# Altium schematic sheet MCU_FM.SchDoc
size A4; Organization: Altium Limited; Address1: L3, 12a Rodborough Rd; Address2: Frenchs Forest; Address3: NSW; Address4: Australia 2086; Stage: DRAFT
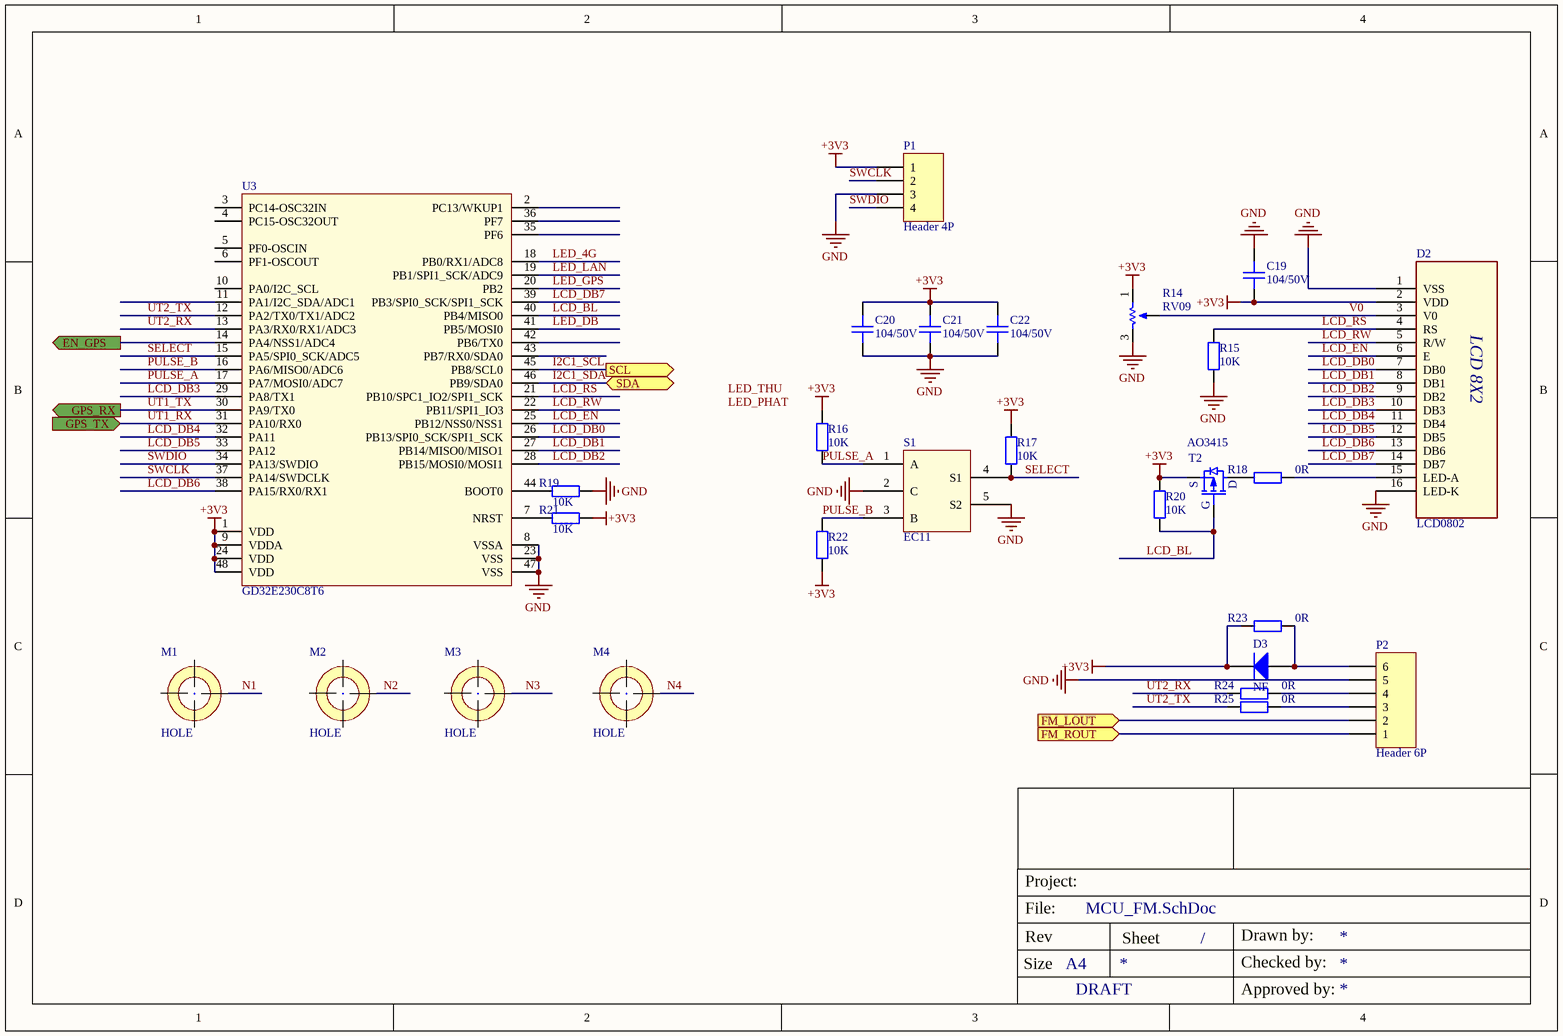
[diagram p0: MCU_FM.SchDoc]

## Parts
C19  104/50V  [CAPC-0603 (1608) - HD]
C20  104/50V  [CAPC-0603 (1608) - HD]
C21  104/50V  [CAPC-0603 (1608) - HD]
C22  104/50V  [CAPC-0603 (1608) - HD]
D2  LCD0802  [LCD 8X2 FORM 3]
D3  NF  [SOD-123]
M1  HOLE  [HOLE_3MM_6MM]  (no BOM)
M2  HOLE  [HOLE_3MM_6MM]  (no BOM)
M3  HOLE  [HOLE_3MM_6MM]  (no BOM)
M4  HOLE  [HOLE_3MM_6MM]  (no BOM)
P1  Header 4P  [HDR1X4 - W]
P2  Header 6P  [HDR1X6 - W]
R14  RV09  [RES_VAR_Type1]
R15  10K  [RESC-0603 (1608) - HD]
R16  10K  [RESC-0603 (1608) - HD]
R17  10K  [RESC-0603 (1608) - HD]
R18  0R  [RESC-0603 (1608) - HD]
R19  10K  [RESC-0603 (1608) - HD]
R20  10K  [RESC-0603 (1608) - HD]
R21  10K  [RESC-0603 (1608) - HD]
R22  10K  [RESC-0603 (1608) - HD]
R23  0R  [RESC-0603 (1608) - HD]
R24  0R  [RESC-0603 (1608) - HD]
R25  0R  [RESC-0603 (1608) - HD]
S1  EC11  [EC11]
T2  AO3415  [SOT23_3]
U3  GD32E230C8T6  [LQFP-48]

## Ports
EN_GPS (out), FM_LOUT (in), FM_ROUT (in), GPS_RX (out), GPS_TX (in), SCL (out), SDA (bidir)

## Nets
+3V3: C19.2 C20.2 C21.2 C22.2 D2.2(VDD) D3.2(K) P1.1 R14.1 R16.2 R17.2 R20.2 R21.2 R22.2 R23.1 T2.2(S) U3.1(VDD) U3.9(VDDA) U3.24(VDD) U3.48(VDD)
GND: C19.1 C20.1 C21.1 C22.1 D2.1(VSS) D2.16(LED-K) P1.3 P2.5 R14.3 R15.1 R19.2 S1.2(C) S1.5(S2) U3.8(VSSA) U3.23(VSS) U3.47(VSS)
EN_GPS: U3.14(PA4/NSS1/ADC4) ; port EN_GPS
FM_LOUT: P2.2 ; port FM_LOUT
FM_ROUT: P2.1 ; port FM_ROUT
I2C1_SCL: U3.45(PB8/SCL0) ; port SCL
I2C1_SDA: U3.46(PB9/SDA0) ; port SDA
LCD_BL: R20.1 T2.1(G) U3.40(PB4/MISO0)
LCD_DB0: D2.7(DB0) U3.26(PB13/SPI0_SCK/SPI1_SCK)
LCD_DB1: D2.8(DB1) U3.27(PB14/MISO0/MISO1)
LCD_DB2: D2.9(DB2) U3.28(PB15/MOSI0/MOSI1)
LCD_DB3: D2.10(DB3) U3.29(PA8/TX1)
LCD_DB4: D2.11(DB4) U3.32(PA11)
LCD_DB5: D2.12(DB5) U3.33(PA12)
LCD_DB6: D2.13(DB6) U3.38(PA15/RX0/RX1)
LCD_DB7: D2.14(DB7) U3.39(PB3/SPI0_SCK/SPI1_SCK)
LCD_EN: D2.6(E) U3.25(PB12/NSS0/NSS1)
LCD_RS: D2.4(RS) R15.2 U3.21(PB10/SPC1_IO2/SPI1_SCK)
LCD_RW: D2.5(R/W) U3.22(PB11/SPI1_IO3)
LED_4G: U3.18(PB0/RX1/ADC8)
LED_DB: U3.41(PB5/MOSI0)
LED_GPS: U3.20(PB2)
LED_LAN: U3.19(PB1/SPI1_SCK/ADC9)
PULSE_A: R16.1 S1.1(A) U3.17(PA7/MOSI0/ADC7)
PULSE_B: R22.1 S1.3(B) U3.16(PA6/MISO0/ADC6)
SELECT: R17.1 S1.4(S1) U3.15(PA5/SPI0_SCK/ADC5)
SWCLK: P1.2 U3.37(PA14/SWDCLK)
SWDIO: P1.4 U3.34(PA13/SWDIO)
UT1_RX: U3.31(PA10/RX0) ; port GPS_TX
UT1_TX: U3.30(PA9/TX0) ; port GPS_RX
UT2_RX: R24.1 U3.13(PA3/RX0/RX1/ADC3)
UT2_TX: R25.1 U3.12(PA2/TX0/TX1/ADC2)
V0: D2.3(V0) R14.2
NetD2_15: D2.15(LED-A) R18.2
NetD3_1: D3.1(A) P2.6 R23.2
NetP2_3: P2.3 R25.2
NetP2_4: P2.4 R24.2
NetR18_1: R18.1 T2.3(D)
NetR19_1: R19.1 U3.44(BOOT0)
NetR21_1: R21.1 U3.7(NRST)

Not connected (* = marked no-connect by the designer): U3 2(PC13/WKUP1) 3(PC14-OSC32IN) 4(PC15-OSC32OUT) 5(PF0-OSCIN) 6(PF1-OSCOUT) 10(PA0/I2C_SCL) 11(PA1/I2C_SDA/ADC1) 35(PF6) 36(PF7) 42(PB6/TX0) 43(PB7/RX0/SDA0)

## Notes on the sheet
- Labels drawn without touching a wire or pin: LED_PHAT, LED_THU
- Project:
- File:
- Size
- Rev
- A4
- Sheet
- /
- Drawn by:
- Checked by:
- Approved by:
- (in symbol LCD0802) LCD 8X2

## Library data of the parts
C19-C22 = C0603C104K5RACTU: CAP CER 0.1uF 50V 10% X7R 0603; CompanyID: VT-00982; Solder: SMT; MPN: C0603C104K5RACTU; Value: 104/50V; Category: CAPACITOR; PinCount: 2
D2 = LCD0802: MFR: China; Solder: Wave; MPN: LCD0802; Company ID: *; Value: LCD0802
D3 = Diode 1N4148: Diode Standard 100V 300mA (DC) Surface Mount SOD-123; Part Number: 1N4148W-7-F; Brand: DIODES; Name: VT_DIODE_1N4148W-7-F
M1-M4 = HOLE_3_5: 3mm/5mm; MPN: None; Solder: Not Fill; CompanyID: VT-; ClassName: MECH_HOLE; Value: HOLE
P1 = Header 4x1: Header, 4 Pin Pitch 2.54mm; MPN: S1012EC-40-ND; Company ID: VT-00125; Solder: WAVE; Value: Header 4P
P2 = Header 6x1: Header, 6 Pin Pitch 2.54mm; MPN: S1012EC-40-ND; CompanyID: VT-00125; Solder: WAVE; Value: Header 6P
R14 = Res Var RV09: Variable Resistor 10K; CMT: 10K
R15-R17 R19-R22 = RC0603FR-0710KL: RES SMD 10K OHM 1% 1/10W 0603; Solder: SMT; Company ID: VT00426; MPN: RC0603FR-0710KL; Value: 10K
R18 R23-R25 = RC0603FR-070RL: RES SMD 0.0OHM JUMPER 1/10W 0603; CompanyID: VT-00901; Solder: SMT; MPN: RC0603FR-070RL; Value: 0R; Category: RESISTOR
S1 = EC11: ENCODER SW EC11 - 20mm; MFR: China; MPN: EC11; URL: https://item.taobao.com/item.htm?spm=a230r.1.14.103.731253f74YATTg&id=579433658537&ns=1&abbucket=4#detail; Company ID: *; Value: EC11
T2 = AO3415: MOSFET P-CH 20V 4A SOT23; MFR: Alpha & Omega Semiconductor Inc.; Value: 20V/4A; Solder: SMT; MPN: AO3415
U3 = GD32E230C8T6: ARM® Cortex®-M23 32-bit MCU 64K Flash 8K RAM; MFR: Gigadevice; MPN: GD32E230C8T6; Value: GD32E230C8T6; Solder: LQFP-48; Category: IC; Company ID: *